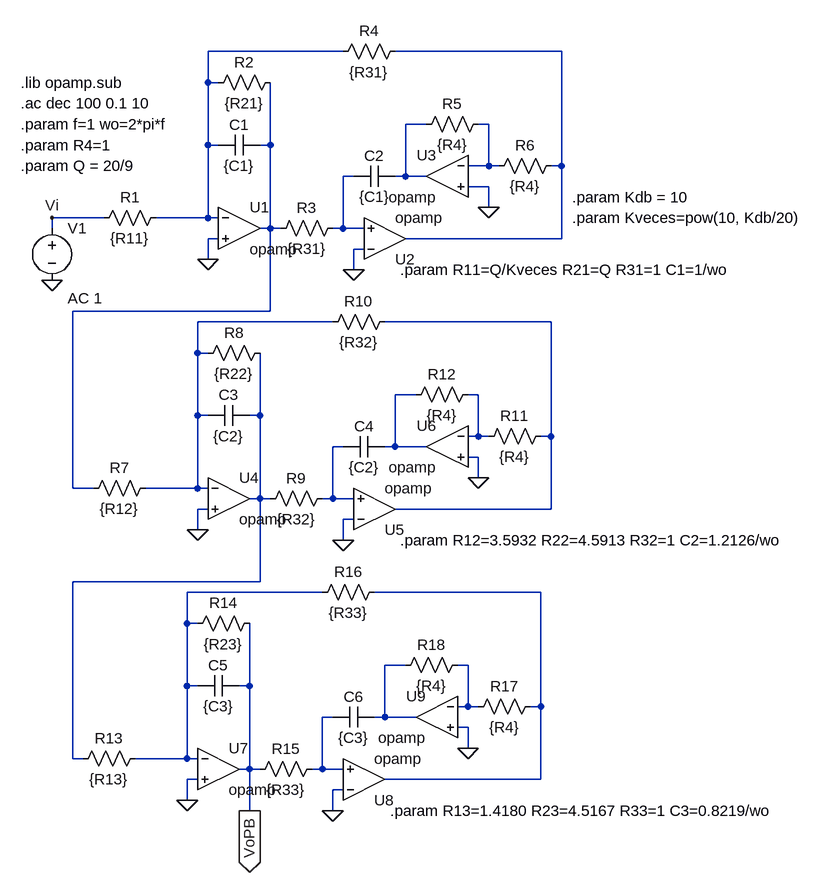
[diagram p0: schematic TPS4_bis.asc]
TPS4_bis.asc, the LTspice schematic file:
Version 4
SHEET 1 1032 1292
WIRE 288 0 80 0
WIRE 624 0 368 0
WIRE 80 48 80 0
WIRE 96 48 80 48
WIRE 416 112 384 112
WIRE 512 112 496 112
WIRE 80 144 80 48
WIRE 96 144 80 144
WIRE 176 144 176 48
WIRE 176 144 160 144
WIRE 512 176 512 112
WIRE 512 176 480 176
WIRE 528 176 512 176
WIRE 624 176 624 0
WIRE 624 176 608 176
WIRE 304 192 288 192
WIRE 384 192 384 112
WIRE 384 192 368 192
WIRE 416 192 384 192
WIRE 512 208 480 208
WIRE 512 240 512 208
WIRE -80 256 -160 256
WIRE 80 256 80 144
WIRE 80 256 0 256
WIRE 96 256 80 256
WIRE -160 272 -160 256
WIRE 176 272 176 144
WIRE 176 272 160 272
WIRE 192 272 176 272
WIRE 288 272 288 192
WIRE 288 272 272 272
WIRE 320 272 288 272
WIRE 96 288 80 288
WIRE 624 288 624 176
WIRE 624 288 384 288
WIRE 320 304 304 304
WIRE 80 320 80 288
WIRE 304 336 304 304
WIRE 176 400 176 272
WIRE 176 400 -128 400
WIRE 272 416 64 416
WIRE 608 416 352 416
WIRE 64 464 64 416
WIRE 80 464 64 464
WIRE 400 528 368 528
WIRE 496 528 480 528
WIRE 64 560 64 464
WIRE 80 560 64 560
WIRE 160 560 160 464
WIRE 160 560 144 560
WIRE 496 592 496 528
WIRE 496 592 480 592
WIRE 512 592 496 592
WIRE 608 592 608 416
WIRE 608 592 592 592
WIRE 288 608 272 608
WIRE 368 608 368 528
WIRE 368 608 352 608
WIRE 416 608 368 608
WIRE 496 624 480 624
WIRE 496 656 496 624
WIRE -128 672 -128 400
WIRE -96 672 -128 672
WIRE 64 672 64 560
WIRE 64 672 -16 672
WIRE 80 672 64 672
WIRE 160 688 160 560
WIRE 160 688 144 688
WIRE 176 688 160 688
WIRE 272 688 272 608
WIRE 272 688 256 688
WIRE 304 688 272 688
WIRE 80 704 64 704
WIRE 608 704 608 592
WIRE 608 704 368 704
WIRE 304 720 288 720
WIRE 64 736 64 704
WIRE 288 752 288 720
WIRE 160 816 160 688
WIRE 160 816 -128 816
WIRE 256 832 48 832
WIRE 592 832 336 832
WIRE 48 880 48 832
WIRE 64 880 48 880
WIRE 384 944 352 944
WIRE 480 944 464 944
WIRE 48 976 48 880
WIRE 64 976 48 976
WIRE 144 976 144 880
WIRE 144 976 128 976
WIRE 480 1008 480 944
WIRE 480 1008 464 1008
WIRE 496 1008 480 1008
WIRE 592 1008 592 832
WIRE 592 1008 576 1008
WIRE 272 1024 256 1024
WIRE 352 1024 352 944
WIRE 352 1024 336 1024
WIRE 400 1024 352 1024
WIRE 480 1040 464 1040
WIRE 480 1072 480 1040
WIRE -128 1088 -128 816
WIRE -112 1088 -128 1088
WIRE 48 1088 48 976
WIRE 48 1088 -32 1088
WIRE 64 1088 48 1088
WIRE 144 1104 144 976
WIRE 144 1104 128 1104
WIRE 160 1104 144 1104
WIRE 256 1104 256 1024
WIRE 256 1104 240 1104
WIRE 288 1104 256 1104
WIRE 64 1120 48 1120
WIRE 592 1120 592 1008
WIRE 592 1120 352 1120
WIRE 288 1136 272 1136
WIRE 48 1152 48 1120
WIRE 144 1168 144 1104
WIRE 272 1168 272 1136
FLAG 80 320 0
FLAG -160 352 0
FLAG 304 336 0
FLAG 512 240 0
FLAG -160 256 Vi
FLAG 64 736 0
FLAG 288 752 0
FLAG 496 656 0
FLAG 48 1152 0
FLAG 272 1168 0
FLAG 480 1072 0
FLAG 144 1168 VoPB
IOPIN 144 1168 Out
SYMBOL res 16 240 R90
WINDOW 0 0 56 VBottom 2
WINDOW 3 32 56 VTop 2
SYMATTR InstName R1
SYMATTR Value {R11}
SYMBOL res 192 32 R90
WINDOW 0 0 56 VBottom 2
WINDOW 3 32 56 VTop 2
SYMATTR InstName R2
SYMATTR Value {R21}
SYMBOL cap 160 128 R90
WINDOW 0 0 32 VBottom 2
WINDOW 3 32 32 VTop 2
SYMATTR InstName C1
SYMATTR Value {C1}
SYMBOL OpAmps\\opamp 128 208 R0
SYMATTR InstName U1
SYMBOL res 288 256 R90
WINDOW 0 0 56 VBottom 2
WINDOW 3 32 56 VTop 2
SYMATTR InstName R3
SYMATTR Value {R31}
SYMBOL voltage -160 256 R0
WINDOW 123 24 124 Left 2
WINDOW 39 0 0 Left 0
SYMATTR Value2 AC 1
SYMATTR InstName V1
SYMATTR Value ""
SYMBOL res 384 -16 R90
WINDOW 0 0 56 VBottom 2
WINDOW 3 32 56 VTop 2
SYMATTR InstName R4
SYMATTR Value {R31}
SYMBOL OpAmps\\opamp 352 352 M180
SYMATTR InstName U2
SYMBOL cap 368 176 R90
WINDOW 0 0 32 VBottom 2
WINDOW 3 32 32 VTop 2
SYMATTR InstName C2
SYMATTR Value {C1}
SYMBOL OpAmps\\opamp 448 128 M0
SYMATTR InstName U3
SYMBOL res 624 160 R90
WINDOW 0 0 56 VBottom 2
WINDOW 3 32 56 VTop 2
SYMATTR InstName R6
SYMATTR Value {R4}
SYMBOL res 512 96 R90
WINDOW 0 0 56 VBottom 2
WINDOW 3 32 56 VTop 2
SYMATTR InstName R5
SYMATTR Value {R4}
SYMBOL res 0 656 R90
WINDOW 0 0 56 VBottom 2
WINDOW 3 32 56 VTop 2
SYMATTR InstName R7
SYMATTR Value {R12}
SYMBOL res 176 448 R90
WINDOW 0 0 56 VBottom 2
WINDOW 3 32 56 VTop 2
SYMATTR InstName R8
SYMATTR Value {R22}
SYMBOL cap 144 544 R90
WINDOW 0 0 32 VBottom 2
WINDOW 3 32 32 VTop 2
SYMATTR InstName C3
SYMATTR Value {C2}
SYMBOL OpAmps\\opamp 112 624 R0
SYMATTR InstName U4
SYMBOL res 272 672 R90
WINDOW 0 0 56 VBottom 2
WINDOW 3 32 56 VTop 2
SYMATTR InstName R9
SYMATTR Value {R32}
SYMBOL res 368 400 R90
WINDOW 0 0 56 VBottom 2
WINDOW 3 32 56 VTop 2
SYMATTR InstName R10
SYMATTR Value {R32}
SYMBOL cap 352 592 R90
WINDOW 0 0 32 VBottom 2
WINDOW 3 32 32 VTop 2
SYMATTR InstName C4
SYMATTR Value {C2}
SYMBOL res 608 576 R90
WINDOW 0 0 56 VBottom 2
WINDOW 3 32 56 VTop 2
SYMATTR InstName R11
SYMATTR Value {R4}
SYMBOL res 496 512 R90
WINDOW 0 0 56 VBottom 2
WINDOW 3 32 56 VTop 2
SYMATTR InstName R12
SYMATTR Value {R4}
SYMBOL res -16 1072 R90
WINDOW 0 0 56 VBottom 2
WINDOW 3 32 56 VTop 2
SYMATTR InstName R13
SYMATTR Value {R13}
SYMBOL res 160 864 R90
WINDOW 0 0 56 VBottom 2
WINDOW 3 32 56 VTop 2
SYMATTR InstName R14
SYMATTR Value {R23}
SYMBOL cap 128 960 R90
WINDOW 0 0 32 VBottom 2
WINDOW 3 32 32 VTop 2
SYMATTR InstName C5
SYMATTR Value {C3}
SYMBOL OpAmps\\opamp 96 1040 R0
SYMATTR InstName U7
SYMBOL res 256 1088 R90
WINDOW 0 0 56 VBottom 2
WINDOW 3 32 56 VTop 2
SYMATTR InstName R15
SYMATTR Value {R33}
SYMBOL res 352 816 R90
WINDOW 0 0 56 VBottom 2
WINDOW 3 32 56 VTop 2
SYMATTR InstName R16
SYMATTR Value {R33}
SYMBOL cap 336 1008 R90
WINDOW 0 0 32 VBottom 2
WINDOW 3 32 32 VTop 2
SYMATTR InstName C6
SYMATTR Value {C3}
SYMBOL res 592 992 R90
WINDOW 0 0 56 VBottom 2
WINDOW 3 32 56 VTop 2
SYMATTR InstName R17
SYMATTR Value {R4}
SYMBOL res 480 928 R90
WINDOW 0 0 56 VBottom 2
WINDOW 3 32 56 VTop 2
SYMATTR InstName R18
SYMATTR Value {R4}
SYMBOL OpAmps\\opamp 336 768 M180
SYMATTR InstName U5
SYMBOL OpAmps\\opamp 320 1184 M180
SYMATTR InstName U8
SYMBOL OpAmps\\opamp 448 544 M0
SYMATTR InstName U6
SYMBOL OpAmps\\opamp 432 960 M0
SYMATTR InstName U9
TEXT -208 48 Left 2 !.lib opamp.sub
TEXT -208 80 Left 2 !.ac dec 100 0.1 10
TEXT -208 112 Left 2 !.param f=1 wo=2*pi*f
TEXT 376 336 Left 2 !.param R11=Q/Kveces R21=Q R31=1 C1=1/wo
TEXT -208 144 Left 2 !.param R4=1
TEXT 376 752 Left 2 !.param R12=3.5932 R22=4.5913 R32=1 C2=1.2126/wo
TEXT 360 1168 Left 2 !.param R13=1.4180 R23=4.5167 R33=1 C3=0.8219/wo
TEXT -208 176 Left 2 !.param Q = 20/9
TEXT 640 256 Left 2 !.param Kveces=pow(10, Kdb/20)
TEXT 640 224 Left 2 !.param Kdb = 10

The netlist it stands for:
* TPS4_bis.asc
R1 N001 Vi {R11}
R2 N005 N001 {R21}
C1 N005 N001 {C1}
XU1 N001 0 N005 opamp Aol=100K GBW=10Meg  ; pins invin noninvin out
R3 N006 N005 {R31}
V1 Vi 0 AC 1
R4 N002 N001 {R31}
XU2 0 N006 N002 opamp Aol=100K GBW=10Meg  ; pins invin noninvin out
C2 N003 N006 {C1}
XU3 N004 0 N003 opamp Aol=100K GBW=10Meg  ; pins invin noninvin out
R6 N002 N004 {R4}
R5 N004 N003 {R4}
R7 N007 N005 {R12}
R8 N011 N007 {R22}
C3 N011 N007 {C2}
XU4 N007 0 N011 opamp Aol=100K GBW=10Meg  ; pins invin noninvin out
R9 N012 N011 {R32}
R10 N008 N007 {R32}
C4 N009 N012 {C2}
R11 N008 N010 {R4}
R12 N010 N009 {R4}
R13 N013 N011 {R13}
R14 VoPB N013 {R23}
C5 VoPB N013 {C3}
XU7 N013 0 VoPB opamp Aol=100K GBW=10Meg  ; pins invin noninvin out
R15 N017 VoPB {R33}
R16 N014 N013 {R33}
C6 N015 N017 {C3}
R17 N014 N016 {R4}
R18 N016 N015 {R4}
XU5 0 N012 N008 opamp Aol=100K GBW=10Meg  ; pins invin noninvin out
XU8 0 N017 N014 opamp Aol=100K GBW=10Meg  ; pins invin noninvin out
XU6 N010 0 N009 opamp Aol=100K GBW=10Meg  ; pins invin noninvin out
XU9 N016 0 N015 opamp Aol=100K GBW=10Meg  ; pins invin noninvin out
.lib opamp.sub
.ac dec 100 0.1 10
.param f=1 wo=2*pi*f
.param R11=Q/Kveces R21=Q R31=1 C1=1/wo
.param R4=1
.param R12=3.5932 R22=4.5913 R32=1 C2=1.2126/wo
.param R13=1.4180 R23=4.5167 R33=1 C3=0.8219/wo
.param Q = 20/9
.param Kveces=pow(10, Kdb/20)
.param Kdb = 10
.backanno
.end

* Results of the author's LTspice run, read from the files saved beside the schematic
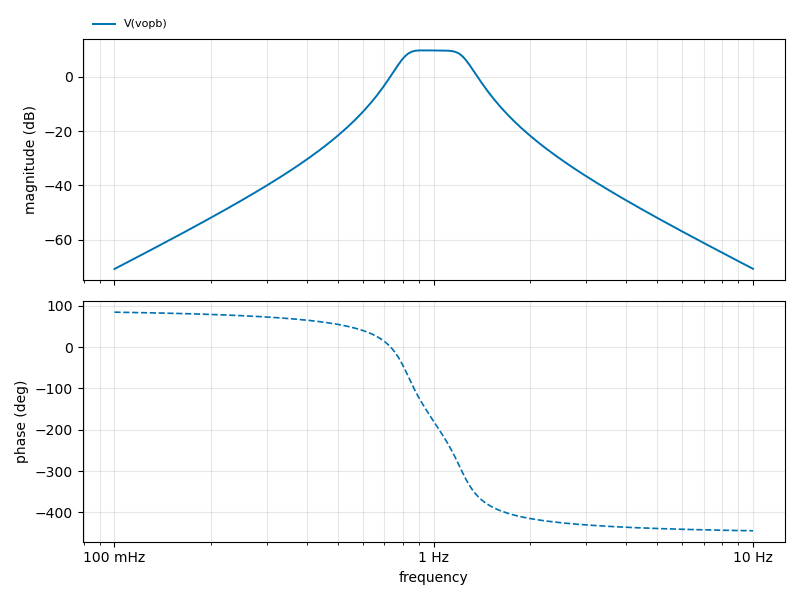
[diagram p1: AC Analysis of TPS4_bis.asc, plotted from the saved traces]
* AC Analysis, 1 run:
*   V(vopb): -70.85 dB at 100 mHz, -70.79 dB at 10 Hz, peak 9.81 dB at 933.3 mHz, 3 dB below the peak at 801.1 mHz and 1.248 Hz